# Altium schematic sheet Working.SchDoc
size C; SheetNumber: 1; SheetTotal: 1
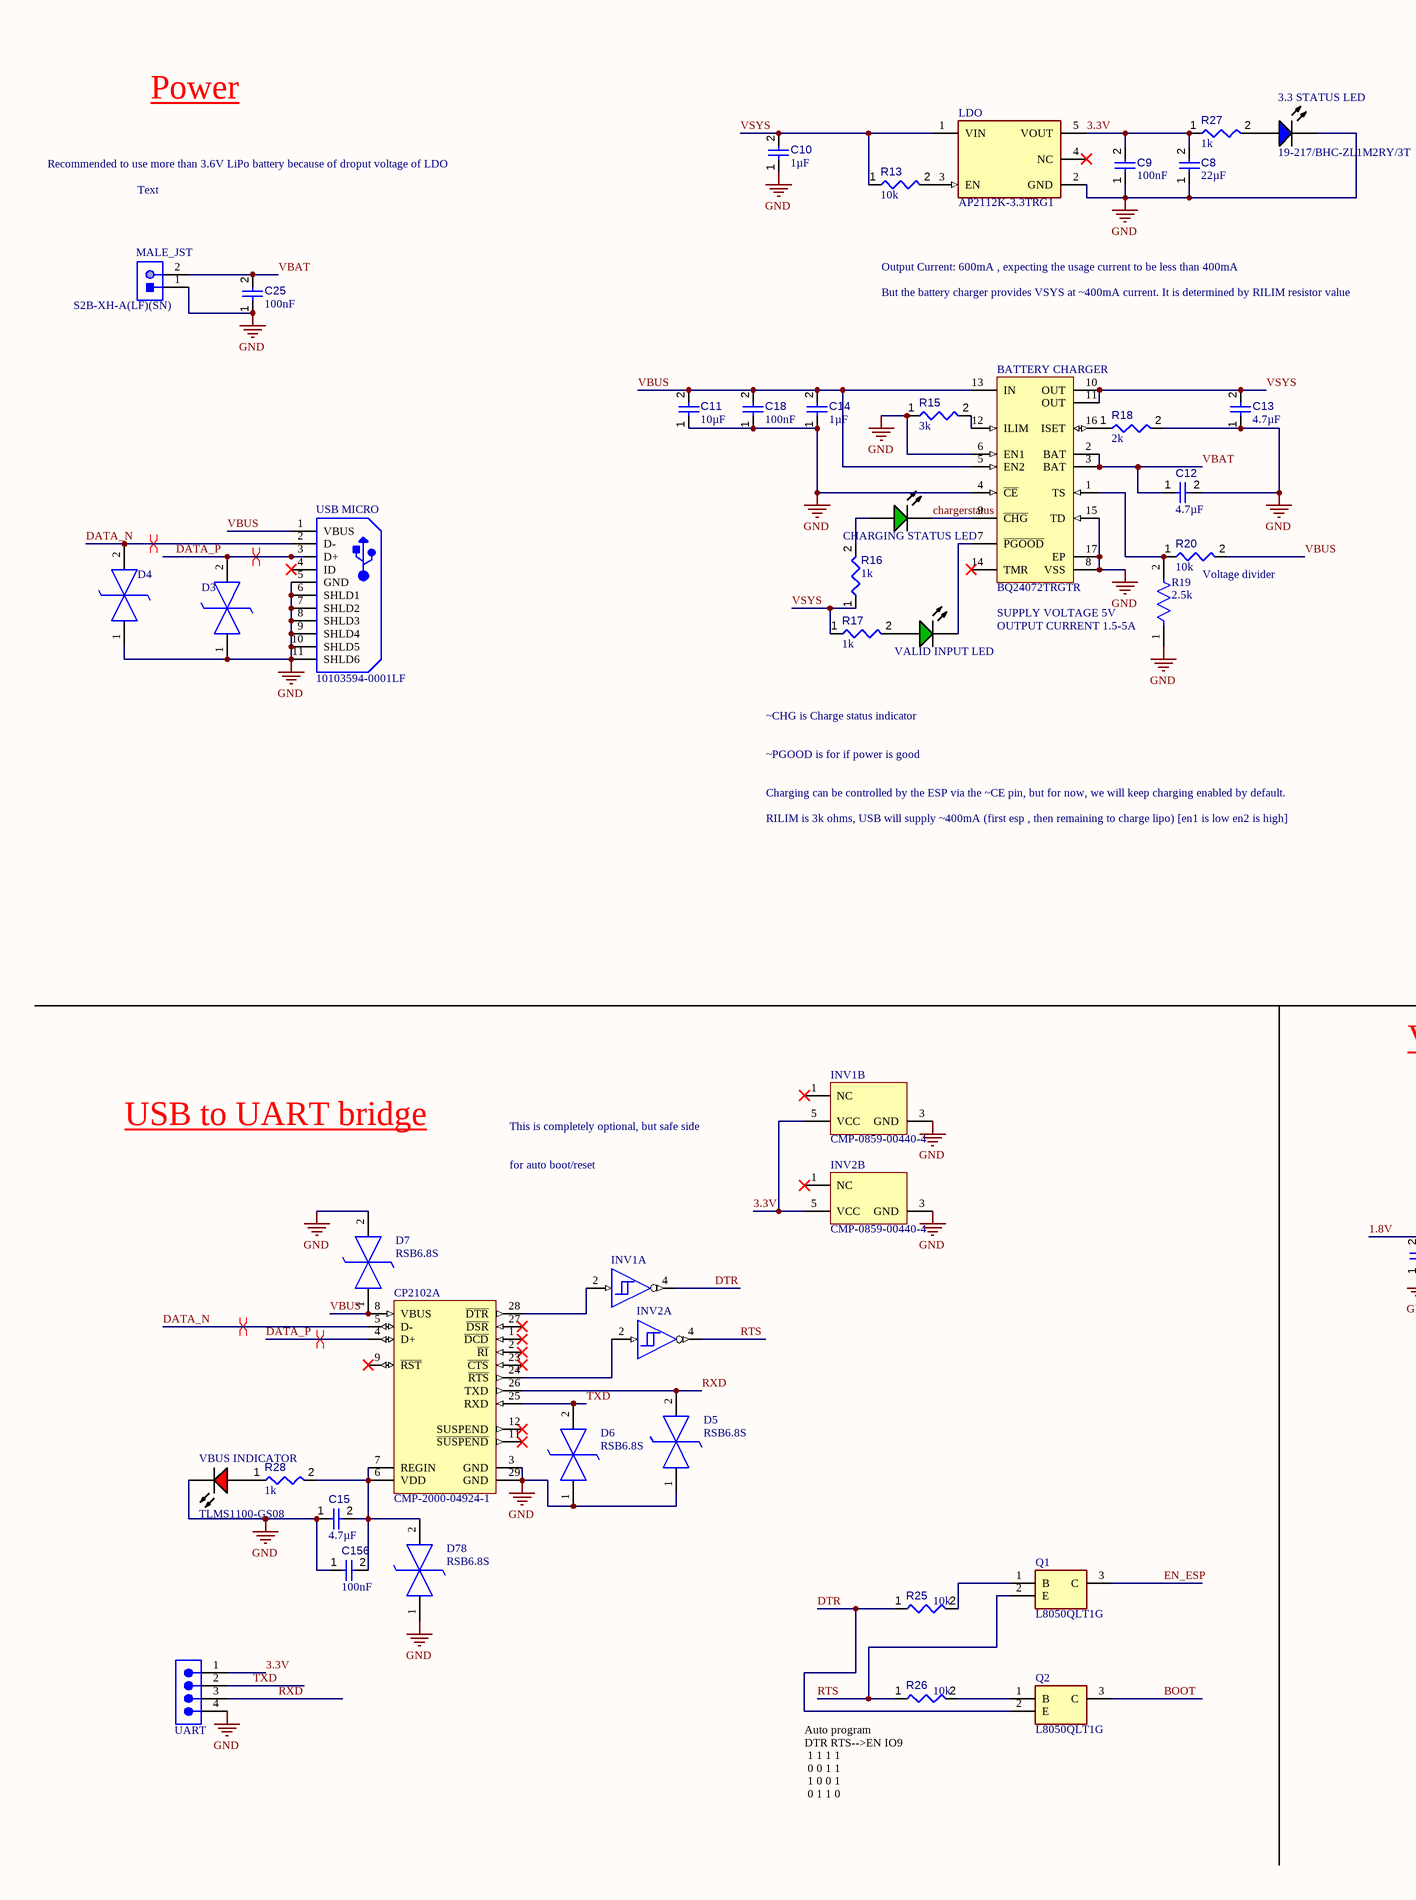
[diagram p0: Working.SchDoc, left]
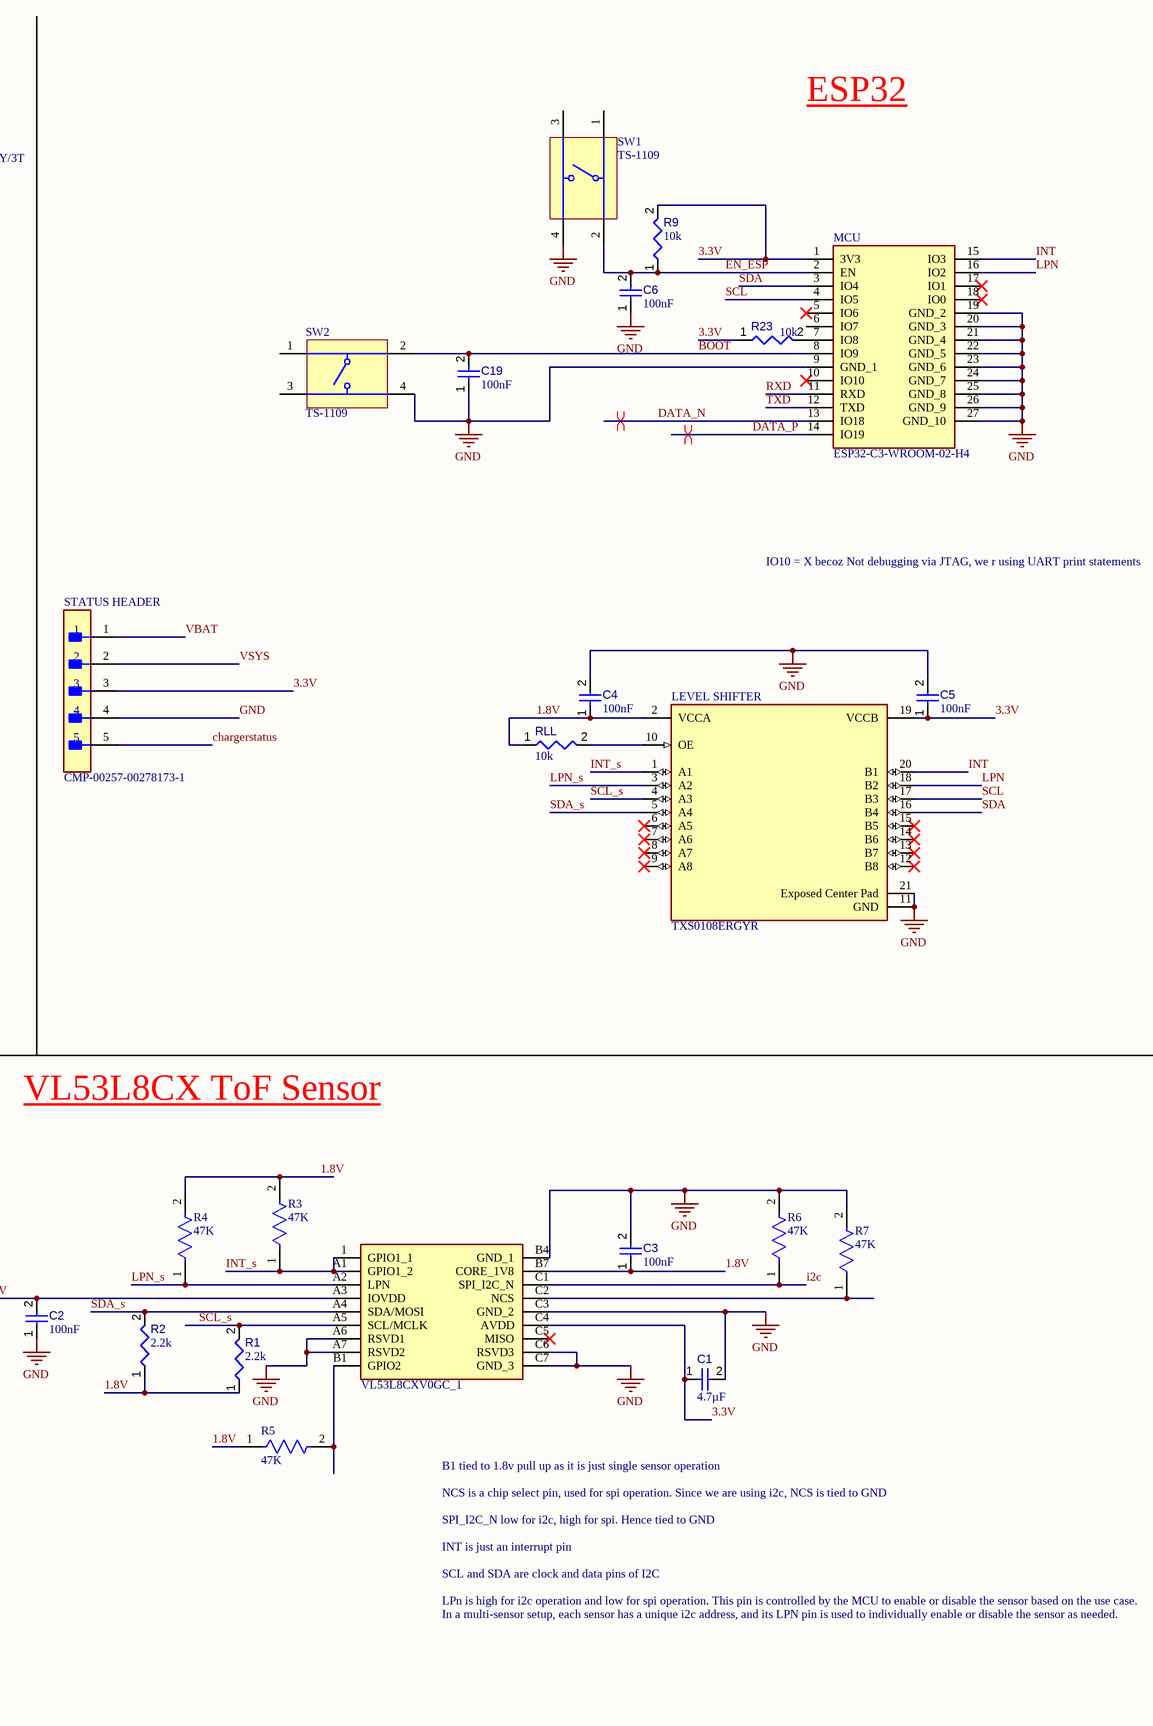
[diagram p1: Working.SchDoc, right]

## Parts
3.3_STATUS_LED  19-217/BHC-ZL1M2RY/3T  [EVRL-0603-2_V]
BATTERY_CHARGER  BQ24072TRGTR  [RGT0016C_V]
C1  value 4.7µF  [CAPC0805(2012)145_L]  (hidden comment: Capacitor 4.7µF +/-40% 25V 0805)
C2  value 100nF  [CAPC0402(1005)60_L]  (hidden comment: Capacitor 100nF +/-20% 50V 0402)
C3  value 100nF  [CAPC0402(1005)60_L]  (hidden comment: Capacitor 100nF +/-20% 50V 0402)
C4  value 100nF  [CAPC1005X56X25LL10T15]  (hidden comment: Capacitor 0.1 uF +/- 5% 16 V 0402)
C5  value 100nF  [CAPC1005X56X25LL10T15]  (hidden comment: Capacitor 0.1 uF +/- 5% 16 V 0402)
C6  value 100nF  [CAPC1005X56X25LL10T15]  (hidden comment: Capacitor 0.1 uF +/- 5% 16 V 0402)
C8  value 22µF  [CAPC0805(2012)145_L]  (hidden comment: Capacitor 22µF +/-40% 16V 0805)
C9  value 100nF  [CAPC1005X56X25LL10T15]  (hidden comment: Capacitor 0.1 uF +/- 5% 16 V 0402)
C10  value 1µF  [CAPC1608X90X35ML15T15]  (hidden comment: Capacitor 1uF +/- 10% 16V 0603)
C11  value 10µF  [CAPC0402(1005)60_L]  (hidden comment: Capacitor 10µF +/-40% 6.3V 0402)
C12  value 4.7µF  [CAPC0805(2012)145_L]  (hidden comment: Capacitor 4.7µF +/-40% 25V 0805)
C13  value 4.7µF  [CAPC0805(2012)145_L]  (hidden comment: Capacitor 4.7µF +/-40% 25V 0805)
C14  value 1µF  [CAPC1608X90X35ML15T15]  (hidden comment: Capacitor 1uF +/- 10% 16V 0603)
C15  value 4.7µF  [CAPC0805(2012)145_L]  (hidden comment: Capacitor 4.7µF +/-40% 25V 0805)
C18  value 100nF  [CAPC1005X56X25LL10T15]  (hidden comment: Capacitor 0.1 uF +/- 5% 16 V 0402)
C19  value 100nF  [CAPC1005X56X25LL10T15]  (hidden comment: Capacitor 0.1 uF +/- 5% 16 V 0402)
C25  value 100nF  [CAPC1005X56X25LL10T15]  (hidden comment: Capacitor 0.1 uF +/- 5% 16 V 0402)
C156  value 100nF  [CAPC1005X56X25LL10T15]  (hidden comment: Capacitor 0.1 uF +/- 5% 16 V 0402)
CHARGING_STATUS_LED  LTST-C190GKT  [LTST-C190GKT_V]  (value not drawn)
CP2102  CMP-2000-04924-1  [SLAB-QFN-28-3125x3125TP_M]  (part A of 2)
D3  RSB6.8S  [SODFL1608X70N]  (value not drawn)
D4  RSB6.8S  [SODFL1608X70N]  (value not drawn)
D5  RSB6.8S  [SODFL1608X70N]
D6  RSB6.8S  [SODFL1608X70N]
D7  RSB6.8S  [SODFL1608X70N]
D78  RSB6.8S  [SODFL1608X70N]
INV1  CMP-0859-00440-4  [DCK0005A_N]  (value not drawn)  (parts A,B of 2)
INV2  CMP-0859-00440-4  [DCK0005A_N]  (value not drawn)  (parts A,B of 2)
LDO  AP2112K-3.3TRG1  [FP-SOT25-IPC_A]
LEVEL_SHIFTER  TXS0108ERGYR  [FP-RGY0020A-MFG]
MALE_JST  S2B-XH-A(LF)(SN)  [JST-S2B-XH-A(LF)(SN)_V]
MCU  ESP32-C3-WROOM-02-H4  [ESP32C3WROOM02H4]
Q1  L8050QLT1G  [L8050QLT1G]
Q2  L8050QLT1G  [L8050QLT1G]
R1  value 2.2k  [RESC0402(1005)_L]  (hidden comment: Resistor 2K2  +/-5 % 0402 63 mW)
R2  value 2.2k  [RESC0402(1005)_L]  (hidden comment: Resistor 2K2  +/-5 % 0402 63 mW)
R3  47K  [FP-AC0603-IPC_B]
R4  47K  [FP-AC0603-IPC_B]
R5  47K  [FP-AC0603-IPC_B]
R6  47K  [FP-AC0603-IPC_B]
R7  47K  [FP-AC0603-IPC_B]
R9  value 10k  [RESC0402(1005)_L]  (hidden comment: Resistor 10K  +/-1 % 0402 63 mW)
R13  value 10k  [RESC0402(1005)_L]  (hidden comment: Resistor 10K  +/-1 % 0402 63 mW)
R15  value 3k  [RESC0402(1005)_L]  (hidden comment: Resistor 3K +/-1 % 0402 63 mW)
R16  value 1k  [RESC0805(2012)_L]  (hidden comment: Resistor 1K +/-5% 0805 125 mW)
R17  value 1k  [RESC0805(2012)_L]  (hidden comment: Resistor 1K +/-5% 0805 125 mW)
R18  value 2k  [RESC0402(1005)_L]  (hidden comment: Resistor 2K +/-5 % 0402 63 mW)
R19  2.5k  [FP-PLTU1206-MFG]
R20  value 10k  [RESC0402(1005)_L]  (hidden comment: Resistor 10K  +/-1 % 0402 63 mW)
R23  value 10k  [RESC0402(1005)_L]  (hidden comment: Resistor 10K  +/-1 % 0402 63 mW)
R25  value 10k  [RESC0402(1005)_L]  (hidden comment: Resistor 10K  +/-1 % 0402 63 mW)
R26  value 10k  [RESC0402(1005)_L]  (hidden comment: Resistor 10K  +/-1 % 0402 63 mW)
R27  value 1k  [RESC0805(2012)_L]  (hidden comment: Resistor 1K +/-5% 0805 125 mW)
R28  value 1k  [RESC0805(2012)_L]  (hidden comment: Resistor 1K +/-5% 0805 125 mW)
RLL  value 10k  [RESC0402(1005)_L]  (hidden comment: Resistor 10K  +/-1 % 0402 63 mW)
SENSOR  VL53L8CXV0GC_1  [VL53L8CXV0GC1]
STATUS_HEADER  CMP-00257-00278173-1  [FP-22-28-4050-MFG]
SW1  TS-1109  [BEST-TS-1109_V]
SW2  TS-1109  [BEST-TS-1109_V]
UART  TSW-104-08-G-S  [SMTC-TSW-104-08-X-S]  (value not drawn)
USB_MICRO  10103594-0001LF  [FCI-10103594-0001LF_V]
VALID_INPUT_LED  LTST-C190GKT  [LTST-C190GKT_V]  (value not drawn)
VBUS_INDICATOR  TLMS1100-GS08  [VISH-TLMX1100_V]

## Nets
GND: 3.3_STATUS_LED.2(K) BATTERY_CHARGER.4(~{CE}) BATTERY_CHARGER.6(EN1) BATTERY_CHARGER.8(VSS) BATTERY_CHARGER.15(TD) BATTERY_CHARGER.17(EP) C1.2 C2.1 C3.2 C4.2 C5.2 C6.1 C8.1 C9.1 C10.1 C11.1 C12.2 C13.1 C14.1 C15.1 C18.1 C19.1 C25.1 C156.1 CP2102.3(GND) CP2102.29(GND) D3.1(K1) D4.1(K1) D5.1(K1) D6.1(K1) D7.2(K2) D78.1(K1) INV1.3(GND) INV2.3(GND) LDO.2(GND) LEVEL_SHIFTER.11(GND) LEVEL_SHIFTER.21(Exposed_Center_Pad) MALE_JST.1 MCU.9(GND_1) MCU.19(GND_2) MCU.20(GND_3) MCU.21(GND_4) MCU.22(GND_5) MCU.23(GND_6) MCU.24(GND_7) MCU.25(GND_8) MCU.26(GND_9) MCU.27(GND_10) R6.2 R7.2 R15.1 R18.2 R19.1 SENSOR.A6(RSVD1) SENSOR.A7(RSVD2) SENSOR.B4(GND_1) SENSOR.C3(GND_2) SENSOR.C6(RSVD3) SENSOR.C7(GND_3) STATUS_HEADER.4 SW1.4 SW2.4 UART.4 USB_MICRO.5(GND) USB_MICRO.6(SHLD1) USB_MICRO.7(SHLD2) USB_MICRO.8(SHLD3) USB_MICRO.9(SHLD4) USB_MICRO.10(SHLD5) USB_MICRO.11(SHLD6) VBUS_INDICATOR.2(K)
1.8V: C2.2 C3.1 C4.1 LEVEL_SHIFTER.2(VCCA) R1.1 R2.1 R3.2 R4.2 R5.1 RLL.1 SENSOR.A3(IOVDD) SENSOR.B7(CORE_1V8)
3.3V: C1.1 C5.1 C8.2 C9.2 INV1.5(VCC) INV2.5(VCC) LDO.5(VOUT) LEVEL_SHIFTER.19(VCCB) MCU.1(3V3) R9.2 R23.1 R27.1 SENSOR.C4(AVDD) STATUS_HEADER.3 UART.1
BOOT: C19.2 MCU.8(IO9) Q2.3(C) SW2.2
chargerstatus: BATTERY_CHARGER.9(~{CHG}) CHARGING_STATUS_LED.2(K) STATUS_HEADER.5
DATA_N: CP2102.5(D-) D4.2(K2) MCU.13(IO18) USB_MICRO.2(D-)
DATA_P: CP2102.4(D+) D3.2(K2) MCU.14(IO19) USB_MICRO.3(D+)
DTR: INV1.4(Y) Q2.2(E) R25.1
EN_ESP: C6.2 MCU.2(EN) Q1.3(C) R9.1 SW1.2
i2c: R6.1 SENSOR.C1(SPI_I2C_N)
INT: LEVEL_SHIFTER.20(B1) MCU.15(IO3)
INT_s: LEVEL_SHIFTER.1(A1) R3.1 SENSOR.1(GPIO1_1) SENSOR.A1(GPIO1_2)
LPN: LEVEL_SHIFTER.18(B2) MCU.16(IO2)
LPN_s: LEVEL_SHIFTER.3(A2) R4.1 SENSOR.A2(LPN)
RTS: INV2.4(Y) Q1.2(E) R26.1
RXD: CP2102.26(TXD) D5.2(K2) MCU.11(RXD) UART.3
SCL: LEVEL_SHIFTER.17(B3) MCU.4(IO5)
SCL_s: LEVEL_SHIFTER.4(A3) R1.2 SENSOR.A5(SCL/MCLK)
SDA: LEVEL_SHIFTER.16(B4) MCU.3(IO4)
SDA_s: LEVEL_SHIFTER.5(A4) R2.2 SENSOR.A4(SDA/MOSI)
TXD: CP2102.25(RXD) D6.2(K2) MCU.12(TXD) UART.2
VBAT: BATTERY_CHARGER.2(BAT) BATTERY_CHARGER.3(BAT) C12.1 C25.2 MALE_JST.2 STATUS_HEADER.1
VBUS: BATTERY_CHARGER.5(EN2) BATTERY_CHARGER.13(IN) C11.2 C14.2 C18.2 CP2102.8(VBUS) D7.1(K1) R20.2 USB_MICRO.1(VBUS)
VSYS: BATTERY_CHARGER.10(OUT) BATTERY_CHARGER.11(OUT) C10.2 C13.2 LDO.1(VIN) R13.1 R16.1 R17.1 STATUS_HEADER.2
Net3.3_STATUS_LED_1: 3.3_STATUS_LED.1(A) R27.2
NetBATTERY_CHARGER_1: BATTERY_CHARGER.1(TS) R19.2 R20.1
NetBATTERY_CHARGER_7: BATTERY_CHARGER.7(~{PGOOD}) VALID_INPUT_LED.2(K)
NetBATTERY_CHARGER_12: BATTERY_CHARGER.12(ILIM) R15.2
NetBATTERY_CHARGER_16: BATTERY_CHARGER.16(ISET) R18.1
NetC15_2: C15.2 C156.2 CP2102.6(VDD) CP2102.7(REGIN) D78.2(K2) R28.2
NetCHARGING_STATUS_LED_1: CHARGING_STATUS_LED.1(A) R16.2
NetCP2102_24: CP2102.24(~{RTS}) INV2.2(A)
NetCP2102_28: CP2102.28(~{DTR}) INV1.2(A)
NetLDO_3: LDO.3(EN) R13.2
NetLEVEL_SHIFTER_10: LEVEL_SHIFTER.10(OE) RLL.2
NetMCU_7: MCU.7(IO8) R23.2
NetQ1_1: Q1.1(B) R25.2
NetQ2_1: Q2.1(B) R26.2
NetR5_2: R5.2 SENSOR.B1(GPIO2)
NetR7_1: R7.1 SENSOR.C2(NCS)
NetR17_2: R17.2 VALID_INPUT_LED.1(A)
NetR28_1: R28.1 VBUS_INDICATOR.1(A)

Not connected (* = marked no-connect by the designer): BATTERY_CHARGER 14(TMR)*; CP2102 1(~{DCD})* 2(~{RI})* 9(~{RST})* 11(~{SUSPEND})* 12(SUSPEND)* 23(~{CTS})* 27(~{DSR})*; INV1 1(NC)*; INV2 1(NC)*; LDO 4(NC)*; LEVEL_SHIFTER 6(A5)* 7(A6)* 8(A7)* 9(A8)* 12(B8)* 13(B7)* 14(B6)* 15(B5)*; MCU 5(IO6)* 6(IO7) 10(IO10)* 17(IO1)* 18(IO0)*; SENSOR C5(MISO)*; SW1 1 3; SW2 1 3; USB_MICRO 4(ID)*

## Layout directives
differential pair: DATA_N, DATA_P

## Notes on the sheet
- Power
- ESP32
- Recommended to use more than 3.6V LiPo battery because of droput voltage of LDO
- Text
- Output Current: 600mA , expecting the usage current to be less than 400mA
- But the battery charger provides VSYS at ~400mA current. It is determined by RILIM resistor value
- (near R20) Voltage divider
- IO10 = X becoz Not debugging via JTAG, we r using UART print statements
- (near BATTERY_CHARGER) SUPPLY VOLTAGE 5V
- OUTPUT CURRENT 1.5-5A
- ~CHG is Charge status indicator
- ~PGOOD is for if power is good
- RILIM is 3k ohms, USB will supply ~400mA (first esp , then remaining to charge lipo) [en1 is low en2 is high]
- Charging can be controlled by the ESP via the ~CE pin, but for now, we will keep charging enabled by default.
- VL53L8CX ToF Sensor
- USB to UART bridge
- This is completely optional, but safe side
- for auto boot/reset
- B1 tied to 1.8v pull up as it is just single sensor operation
- NCS is a chip select pin, used for spi operation. Since we are using i2c, NCS is tied to GND
- SPI_I2C_N low for i2c, high for spi. Hence tied to GND
- INT is just an interrupt pin
- SCL and SDA are clock and data pins of I2C
- LPn is high for i2c operation and low for spi operation. This pin is controlled by the MCU to enable or disable the sensor based on the use case.
- In a multi-sensor setup, each sensor has a unique i2c address, and its LPN pin is used to individually enable or disable the sensor as needed.
- (near R26) Auto program
  DTR RTS-->EN IO9
  1 1 1 1
  0 0 1 1
  1 0 0 1
  0 1 1 0

## Library data of the parts
3.3_STATUS_LED = CMP-007-00003-2: Chip LED, Blue, 5 V, 25 mA, -40 to 85 degC, 2-Pin SMD (0603), RoHS, Tape and Reel; Manufacturer: Everlight Electronics; Luminous Intensity: 28.5mcd; Viewing Angle: 120degrees; Forward Current: 25mA; Lens Style: Diffused; Forward Voltage: 3V; Pins: 2; Max Operating Temperature: 85°C; Manufacturer URL: http://www.everlight.com/; Datasheet URL: https://datasheet.ciiva.com/26901/getdatasheetpartid-420616-26901324.pdf; Package Reference: 0603; RoHS Compliant: True; Packaging: TapeandReel; Package Description: 2-Pin Surface Mount Device, Body 1.6 x 0.8 mm; Mounting Technology: SM; Datasheet Version: Rev. 1.0, 03/2003; Min Operating Temperature: -40°C; Case/Package: 0603; Colour: Blue
BATTERY_CHARGER = CMP-0321-00268-2: 1.5 A USB-Friendly Li-Ion Battery Charger and Power-Path Management IC, 4.3 V, -40 to 85 degC, 16-pin QFN (RGT), Green (RoHS & no Sb/Br); Manufacturer: Texas Instruments; Over Voltage Protection: N; Li-Ion: Y; SubFamily: Battery Charge Management; Vin(Min)(V): 4.3; Eco-Plan: Green (RoHS & no Sb/Br); Code_JEDEC: MO-220; ComponentLink1Description: Datasheet; Mounting Technology: Surface Mount; PartNumber: BQ24072TRGTR; Lead Acid: N; Li-Polymer: Y; NiMH: N; DatasheetVersion: SLUS937A; NiCd: N; ComponentLink1URL: http://www.ti.com/general/docs/lit/getliterature.tsp?genericPartNumber=BQ24072T&fileType=pdf; PackageDescription: 16-Pin Plastic Quad Flat No-Lead, 3 x 3 mm Body, 0.5 mm Pitch, 1.7 x 1.7 mm Exposed Pad; PackageReference: RGT0016C; PackageVersion: revH, Oct-2011
C1 C12 C13 C15 = CMP-001-00080-4: Chip Capacitor, 4.7µF +/-40%, 25V, 0805, Thickness 1.45 mm; Tolerance: 20%; Voltage Rating: 25V; Min Operating Temperature: -55°C; Max Operating Temperature: 85°C; Pins: 2; Mounting Technology: SMT; Case/Package: 0805
C2 C3 = CMP-001-00067-3: Chip Capacitor, 100nF +/-20%, 50V, 0402, Thickness 0.6 mm; Tolerance: 10%; Min Operating Temperature: -55°C; Pins: 2; Case/Package: 0402; Max Operating Temperature: 85°C; Voltage Rating: 50V; Mounting Technology: SMT
C4-C6 C9 C18 C19 C25 C156 = CMP-001-00001-6: Chip Capacitor, 0.1 uF, +/- 5%, 16 V, 0402 (1005 Metric); Capacitor Type: Ceramic; Voltage Rating: 16V; Max Operating Temperature: 125°C; Min Operating Temperature: -55°C; Case/Package: 0402; Mounting Technology: SM; Pins: 2; Tolerance: 5%; RoHS Compliant: True
C8 = CMP-001-00081-4: Chip Capacitor, 22µF +/-40%, 16V, 0805, Thickness 1.45 mm; Tolerance: 5%; Voltage Rating: 16V; Mounting Technology: SMT; Pins: 2; Max Operating Temperature: 85°C; Case/Package: 0805; Min Operating Temperature: -55°C
C10 C14 = CMP-001-00004-6: Chip Capacitor, 1 uF, +/- 10%, 16 V, 0603 (1608 Metric); Capacitor Type: Ceramic; Mounting Technology: SM; RoHS Compliant: True; Min Operating Temperature: -55°C; Case/Package: 0603; Pins: 2; Voltage Rating: 16V; Max Operating Temperature: 125°C; Tolerance: 10%
C11 = CMP-001-00074-3: Chip Capacitor, 10µF +/-40%, 6.3V, 0402, Thickness 0.6 mm; Tolerance: 10%; Case/Package: 0402; Pins: 2; Mounting Technology: SMT; Voltage Rating: 6.3V; Max Operating Temperature: 85°C; Min Operating Temperature: -55°C
CHARGING_STATUS_LED VALID_INPUT_LED = CMP-007-00022-2: LED Uni-Color Green, 100 mW, 30 mA, -55 to 85 degC, 2-Pin SMD, RoHS, Tape and Reel; Manufacturer: Lite-On; Power: 100mW; Forward Voltage: 2.1V; Viewing Angle: 130degrees; Forward Current: 20mA; Luminous Intensity: 6mcd; Lens Style: Clear; Manufacturer URL: http://www.us.liteon.com/; RoHS Compliant: True; Colour: Green; Package Description: 2-Pin Surface Mount Device, Body 1.6 x 0.8 mm; Datasheet URL: http://datasheet.octopart.com/LTST-C190GKT-Lite-On-datasheet-158530.pdf; Datasheet Version: Dec-06; Mounting Technology: SM; Case/Package: 0603; Package Reference: C190GKT; Packaging: TapeandReel; Min Operating Temperature: -55°C; Nominal Vf: 2.1V; Package Quantity: 3000; Illumination Colour: Green; Max Operating Temperature: 85°C; Pins: 2
CP2102 = CMP-053-000000-1: Single-Chip USB to URAT Bridge, 3.3 V, -40 to 85 degC, 28-Pin QFN, RoHS, Tape and Reel; Manufacturer: Silicon Labs; Operating Supply Voltage (Typ): 3.3V; Data Rate: 1000kbps; Interface Circuit Standard 1: RS-232; Number of Channels: 1; Operating Supply Voltage (Min): 3V; Transmitter and Receiver FIFO Counter: No; Operating Supply Voltage (Max): 3.6V; Supply Current: 26mA; Datasheet Version: Rev. 1.6, 12/2013; Package Reference: QFN-28; Operating Temperature (Max): 85C; Operating Temperature (Min): -40C; Packaging: TapeandReel; Design Item ID: CMP-2000-04924-1; Source: CP2102UART.SchLib; Operating Temperature Classification: Industrial; Pin Count: 28; Component Type: Standard; Package URL: http://www.silabs.com/Support%20Documents/TechnicalDocs/C8051T61x.pdf; Package Description: 28-Pin Quad-Flat No-Leads Package, Body 5 x 5 mm, Pitch 0.5 mm; Manufacturer URL: http://www.silabs.com/; Rad Hardened: No; Mounting: SurfaceMount; Package Type: QFNEP; Datasheet URL: http://www.mouser.com/ds/2/368/CP2102-9-247052.pdf
D3-D7 D78 = CMP-004-00037-1: ESD Suppressor Diode TVS Bi-Dir 4.7V 2-Pin SC-79; Manufacturer_Name: ProTek Devices; Datasheet Link: https://static6.arrow.com/aropdfconversion/672096323c96f449a08c56f24341099c7ad028a0/rsb6_8s.pdf; Arrow Price/Stock: https://www.arrow.com/en/products/rsb6.8s/protek-devices?region=nac; Design Item ID: RSB6.8S; Source: SamacSys.SchLib; Manufacturer_Part_Number: RSB6.8S; Height: 0.7mm; Arrow Part Number: RSB6.8S
INV1 INV2 = CMP-097-000000-1: Single Schmitt-Trigger Inverter, DCK0005A, LARGE T&R; Manufacturer: Texas Instruments; Generic Part Number: SN74LVC1G14; Sub-Family: Inverting Buffer/Driver; Voltage(Nom)(V): 182.5335kV; F @ Nom Voltage(Max)(Mhz): 150; VCC(Min)(V): 1.65; Logic: Inverting; ICC @ Nom Voltage(Max)(mA): 0.01; Output Type: CMOS; tpd @ Nom Voltage(Max)(ns): 11,6.5,5.5,5; Technology Family: LVC; VCC(Max)(V): 5.5; Input Type: CMOS/TTL; Output Drive (IOL/IOH)(Max)(mA): 32/-32; Schmitt Trigger: Yes; Bits(#): 1; Rating: Catalog; 3-State Output: No; DatasheetVersion: SCES218W; Component Type: Standard; PackageReference: DCK0005A; Design Item ID: CMP-0859-00440-4; Source: smallinverter.SchLib; Operating Temperature Range(C): -40 to 125,-40 to 85; Pin Count: 5
LDO = CMP-12756-000035-1: IC REG LINEAR 3.3V 600MA SOT25; Number of Regulators: 1; Output Type: Fixed; Polarity: Positive; Min Input Voltage: 2.5V; Max Input Voltage: 6V; Accuracy: 1.5%; Quiescent Current: 55uA; Dropout Voltage: 250mV; Min Operating Temperature: -40°C; Length: 3.1mm; Output Current: 600mA; Max Operating Temperature: 85°C; Package Quantity: 1; Output Voltage: 3.3V; Width: 1.7mm; Number of Outputs: 1; Packaging: Tape and Reel; Height: 1.3mm; Lead Free: Lead Free; Max Output Current: 600mA; Case/Package: SOT-23-5; Mount: Surface Mount; Number of Pins: 5
LEVEL_SHIFTER = CMP-04899-000066-1: IC TRNSLTR BIDIRECTIONAL 20VQFN; Propagation Delay: 4.8ns; Number of Channels: 8; High Level Output Current: -50mA; Min Supply Voltage: 1.2V; Data Rate: 60Mbps; Quiescent Current: 3uA; Logic Function: Translator; Low Level Output Current: 50mA; Max Supply Voltage: 5.5V; Output Type: Voltage; Turn-On Delay Time: 312ns; Packaging: Tape and Reel; Min Operating Temperature: -40°C; Package Quantity: 1; Case/Package: VQFN; Mount: Surface Mount; Number of Pins: 20; Radiation Hardening: No; Series: -; RoHS Compliant: Yes; REACH SVHC: No SVHC; Max Operating Temperature: 85°C; Number of Bits: 8; Lead Free: Lead Free; Weight: 0.001517oz; Number of Inputs: 8
MALE_JST = CMP-002-00032-2: Male Header, Pitch 2.5 mm, 1 x 2 Position, Height 6.1 mm, Tail Length 3.4 mm, -25 to 85 degC, RoHS, Bulk; Manufacturer: JST; Case/Package: S2B-XH-A(LF)(SN); Package Description: XH Series Disconnectable Crimp Style Connector, Pitch 2.5 mm, 1 x 2 Position, Height 6.1 mm, Tail Length 3.4 mm; Manufacturer URL: http://www.jst.com/home2.html; Datasheet URL: http://www.jst-mfg.com/product/pdf/eng/eXH.pdf; Connector Type: Header; Package Reference: S2B-XH-A(LF)(SN); Mounting Technology: TH; Max Operating Temperature: 85°C; Min Operating Temperature: -25°C; Datasheet Version: May-16; Gender: Male; RoHS Compliant: Unknown
MCU = ESP32-C3-WROOM-02-H4: Integrated Circuit; Manufacturer_Name: Espressif Systems; Datasheet Link: https://www.mouser.in/datasheet/2/891/Espressif_Systems_04082021_ESP32_C3_WROOM_02-2295851.pdf; Height: 3.35mm; Manufacturer_Part_Number: ESP32-C3-WROOM-02-H4; Mouser Part Number: 356-ESP32C3WROOM02H4; Mouser Price/Stock: https://www.mouser.co.uk/ProductDetail/Espressif-Systems/ESP32-C3-WROOM-02-H4?qs=stqOd1AaK79%2FSA14oWtR%252Bw%3D%3D
Q1 Q2 = L8050QLT1G: Integrated Circuit; Manufacturer_Name: LRC; Datasheet Link: https://datasheet.datasheetarchive.com/originals/distributors/Datasheets-28/DSA-558356.pdf; Height: 1.11mm; Manufacturer_Part_Number: L8050QLT1G
R1 R2 = CMP-009-00166-3: Chip Resistor, 2,2 kOhms, +/-5 %, 63 mW, -55 to 155 degC, 0402; Power: 63mW; Tolerance: 5%; Pins: 2; Min Operating Temperature: -55°C; Max Operating Temperature: 155°C; Case/Package: 0402
R3-R7 = CMP-03412-046943-1: RES 47kΩ 1.00% 0.2W 0603
R9 R13 R20 R23 R25 R26 RLL = CMP-009-00149-3: Chip Resistor, 10 kOhms, +/-1 %, 63 mW, -55 to 125 degC, 0402; Power: 63mW; Tolerance: 1%; Min Operating Temperature: -55°C; Case/Package: 0402; Max Operating Temperature: 155°C; Pins: 2
R15 = CMP-009-00145-3: Chip Resistor, 3 kOhms, +/-1 %, 63 mW, -55 to 155 degC, 0402; Tolerance: 1%; Power: 63mW; Case/Package: 0402; Min Operating Temperature: -55°C; Max Operating Temperature: 155°C; Pins: 2
R16 R17 R27 R28 = CMP-009-00118-3: Chip Resistor, 1 kOhms, +/-5%, 125 mW, -55 to 155 degC, 0805; Tolerance: 5%; Power: 125mW; Case/Package: 0805; Pins: 2; Min Operating Temperature: -55°C; Max Operating Temperature: 155°C
R18 = CMP-009-00138-3: Chip Resistor, 2 kOhms, +/-5 %, 63 mW, -55 to 155 degC, 0402; Tolerance: 5%; Power: 63mW; Max Operating Temperature: 155°C; Pins: 2; Min Operating Temperature: -55°C; Case/Package: 0402
R19 = CMP-00030-87848304-1: PLTU1206U2501LST5 Res SMD 2.5K Ohm 0.01% 0.4W 1206; Temperature Coefficient: 2ppm/°C; Max Power Dissipation: 400mW; Voltage Rating: 200V; Resistance: 2.5kΩ; Width: 1.6002mm; RoHS: Compliant; Length: 3.2004mm; Features: Moisture Resistant; Min Operating Temperature: -55°C; Case Code (Imperial): 1206; Case Code (Metric): 3016; Composition: Thin Film; Height: 838.2µm; Case/Package: 1206; Power Rating: 400mW; Max Operating Temperature: 125°C; Number of Terminations: 2; Tolerance: 0.01%; NexarPartId: 87848304
SENSOR = VL53L8CXV0GC_1: Undefined or Miscellaneous; Manufacturer_Name: STMicroelectronics; Manufacturer_Part_Number: VL53L8CXV0GC/1; Datasheet Link: https://www.st.com/resource/en/datasheet/vl53l8cx.pdf; Mouser Part Number: 511-VL53L8CXV0GC/1; Mouser Price/Stock: https://www.mouser.co.uk/ProductDetail/STMicroelectronics/VL53L8CXV0GC-1?qs=T%252BzbugeAwjhc9idkQC%252BF8g%3D%3D; Arrow Part Number: VL53L8CXV0GC/1; Arrow Price/Stock: https://www.arrow.com/en/products/vl53l8cxv0gc1/stmicroelectronics?utm_currency=USD&region=europe
STATUS_HEADER = CMP-002-00072-1: 22-28-4050 KK® 254 Breakaway Header, Vertical, 5 Circuits, Tin (Sn) Plating, Mating Pin Length 6.09mm; NexarPartId: 278173; Connector Type: Male Pin; Voltage Rating (DC): 250V; Gender: Male; Current Rating: 4A; Contact Resistance: 20mO; Glow Wire Compliant: Non-compliant; Number of Contacts: 5; Pitch: 2.54mm; Voltage Rating: 250.25kV; Housing Material: Thermoplastic; RoHS: Compliant; Number of Rows: 1; Width: 2.49mm; Flammability Rating: UL94 V-0; Length: 12.7mm; Contact Mating Length: 6.096mm; Orientation: Vertical; Housing Color: Black; Radiation Hardening: No; Schedule B: 8536694040; Lead Pitch: 2.54mm; Mount: Through Hole; Lead Free: Lead Free; Pins: 5; Termination: Solder; Contact Plating: Tin; Height: 2.29mm; Max Operating Temperature: 75°C; Number of Positions: 5; Contact Material: Brass; Component Type: Standard; REACH SVHC: Unknown; Design Item ID: CMP-00257-00278173-1; Min Operating Temperature: 0°C; Color: Black; Source: 5pin.SchLib; Packaging: Bulk; Number of Circuits: 5
SW1 SW2 = CMP-011-00002-2: Tactile Switch, SPST, 12 V, 50 mA, -20 to 80 degC, 4-Pin THD; Manufacturer: Shenzhen Best; RoHS Compliant: Unknown; Manufacturer URL: www.best-dz.com/; Case/Package: TS-1109; Package Reference: TS-1109; Datasheet Version: Dec-12; Mounting Technology: TH; Package Description: 4-Pin Through Hole Device, Body 6.2 x 6.2 mm; Datasheet URL: http://datasheet.octopart.com/TS-1109-Best-Inc.-datasheet-30458100.pdf
UART = CMP-1024-00357-1: 0.025" SQ Post Header, Through-hole, Vertical, -55 to 125 degC, 2.54 mm Pitch, 4-Pin, Male, RoHS; Manufacturer: Samtec; Pitch: 2.54 mm; RoHS: True; ComponentLink3URL: http://www.samtec.com/documents/webfiles/cpdf/TSW-XXX-XX-XXX-X-XX-XXX-MKT.pdf; Mounting Technology: Through-hole; ComponentLink2URL: http://www.samtec.com/documents/webfiles/pdf/TSW_TH.PDF; ComponentLink1URL: http://www.samtec.com; ComponentLink3Description: Package Specification; PackageVersion: DM, 8/1988; ComponentLink2Description: Datasheet; PackageReference: TSW-104-08-X-S; PackageDescription: .025[0.64] SQ. Post Terminal Strip Assembly; PartNumber: TSW-104-08-G-S; ComponentLink1Description: Manufacturer URL; Temperature Range: -55 to 125 degC; DatasheetVersion: F-214; Orientation: Vertical
USB_MICRO = CMP-002-00038-2: Micro USB 2.0 B Receptacle, 5 Position, Height 3.24 mm, -55 to 85 degC, RoHS, Tape and Reel; Manufacturer: FCI Electronics; Gender: Female; Current Rating: 1.8A; Voltage Rating: 100V; Min Operating Temperature: -55°C; Package Reference: FCI-10103594-0001LF; Max Operating Temperature: 85°C; Lead Pitch: 0.65mm; Case/Package: FCI-10103594-0001LF; Package Quantity: 1500; Connector Type: USB; Mounting Technology: SM; Datasheet Version: Rev. A, 06/2010; Contact Material: Copper; Package Description: 5-Pin Surface Mount Device, Body 8.04 x 5.62 mm; Contact Plating: Gold; Packaging: TapeandReel; Datasheet URL: http://portal.fciconnect.com/Comergent//fci/drawing/10103594.pdf; Pins: 5; RoHS Compliant: True; Manufacturer URL: http://portal.fciconnect.com/
VBUS_INDICATOR = CMP-007-00030-2: Red Led, 20mA, 2.1 V, -40 to 100 degC, 2-Pin SMD (0603), RoHS, Tape and Reel; Manufacturer: Vishay Semiconductor; Viewing Angle: 160degrees; Forward Voltage: 2.1V; Lens Style: Clear; Power: 90mW; Luminous Intensity: 63mcd; Datasheet Version: Rev. 2.7, 03/2016; Package Quantity: 3000; Colour: Red; Package Description: 2-Pin Surface Mount Device, Body 1.6 x 0.8 mm; Datasheet URL: http://www.vishay.com/docs/83173/tlmb1100.pdf; Package Reference: TLMX1100; Max Operating Temperature: 100°C; Mounting Technology: SM; Packaging: TapeandReel; Case/Package: 0603; Illumination Colour: Red; Forward Current: 20mA; Manufacturer URL: http://www.vishay.com/; RoHS Compliant: True; Min Operating Temperature: -40°C; Nominal Vf: 2.1V; Pins: 2